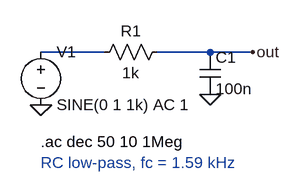
[diagram p0: schematic rc_lowpass.asc]
rc_lowpass.asc, the LTspice schematic file:
Version 4
SHEET 1 880 680
WIRE 128 112 32 112
WIRE 288 112 208 112
WIRE 352 112 288 112
FLAG 32 192 0
FLAG 288 176 0
FLAG 352 112 out
SYMBOL voltage 32 96 R0
WINDOW 123 0 0 Left 0
WINDOW 39 0 0 Left 0
SYMATTR InstName V1
SYMATTR Value SINE(0 1 1k) AC 1
SYMBOL res 224 96 R90
WINDOW 0 0 56 VBottom 2
WINDOW 3 32 56 VTop 2
SYMATTR InstName R1
SYMATTR Value 1k
SYMBOL cap 272 112 R0
SYMATTR InstName C1
SYMATTR Value 100n
TEXT 32 248 Left 2 !.ac dec 50 10 1Meg
TEXT 32 280 Left 2 ;RC low-pass, fc = 1.59 kHz

The netlist it stands for:
* rc_lowpass.asc
V1 N001 0 SINE(0 1 1k) AC 1
R1 out N001 1k
C1 out 0 100n
.ac dec 50 10 1Meg
* RC low-pass, fc = 1.59 kHz
.backanno
.end